# Altium schematic sheet V1.SchDoc
size A4
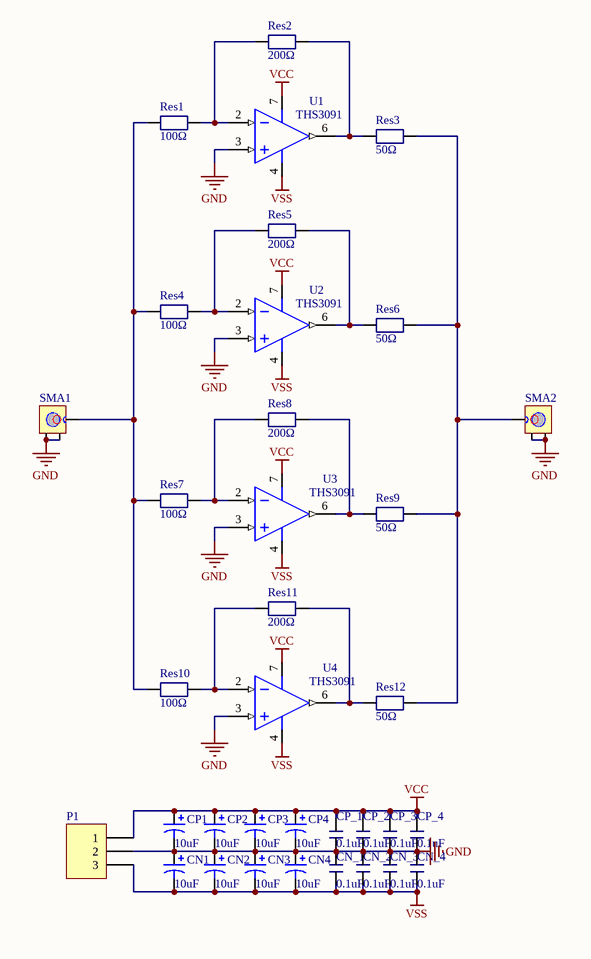
[diagram p0: V1.SchDoc]

## Parts
CN1  value 10uF  [CAP_BTAN]  (hidden comment: Cap Pol1)
CN2  value 10uF  [CAP_BTAN]  (hidden comment: Cap Pol1)
CN3  value 10uF  [CAP_BTAN]  (hidden comment: Cap Pol1)
CN4  value 10uF  [CAP_BTAN]  (hidden comment: Cap Pol1)
CN_1  value 0.1uF  [C0805]  (hidden comment: cap)
CN_2  value 0.1uF  [C0805]  (hidden comment: cap)
CN_3  value 0.1uF  [C0805]  (hidden comment: cap)
CN_4  value 0.1uF  [C0805]  (hidden comment: cap)
CP1  value 10uF  [CAP_BTAN]  (hidden comment: Cap Pol1)
CP2  value 10uF  [CAP_BTAN]  (hidden comment: Cap Pol1)
CP3  value 10uF  [CAP_BTAN]  (hidden comment: Cap Pol1)
CP4  value 10uF  [CAP_BTAN]  (hidden comment: Cap Pol1)
CP_1  value 0.1uF  [C0805]  (hidden comment: cap)
CP_2  value 0.1uF  [C0805]  (hidden comment: cap)
CP_3  value 0.1uF  [C0805]  (hidden comment: cap)
CP_4  value 0.1uF  [C0805]  (hidden comment: cap)
P1  Header 3  [HDR1X3]  (value not drawn)
Res1  value 100Ω  [C0805]  (hidden comment: Res)
Res2  value 200Ω  [R-AXIAL0.3]  (hidden comment: Res)
Res3  value 50Ω  [C0805]  (hidden comment: Res)
Res4  value 100Ω  [C0805]  (hidden comment: Res)
Res5  value 200Ω  [R-AXIAL0.3]  (hidden comment: Res)
Res6  value 50Ω  [C0805]  (hidden comment: Res)
Res7  value 100Ω  [C0805]  (hidden comment: Res)
Res8  value 200Ω  [R-AXIAL0.3]  (hidden comment: Res)
Res9  value 50Ω  [C0805]  (hidden comment: Res)
Res10  value 100Ω  [C0805]  (hidden comment: Res)
Res11  value 200Ω  [R-AXIAL0.3]  (hidden comment: Res)
Res12  value 50Ω  [C0805]  (hidden comment: Res)
SMA1  SMA-xie  [sma-xie]  (value not drawn)
SMA2  SMA-xie  [sma-xie]  (value not drawn)
U1  THS3091  [SOIC-8D]
U2  THS3091  [SOIC-8D]
U3  THS3091  [SOIC-8D]
U4  THS3091  [SOIC-8D]

## Nets
GND: CN1.1 CN2.1 CN3.1 CN4.1 CN_1.1 CN_2.1 CN_3.1 CN_4.1 CP1.2 CP2.2 CP3.2 CP4.2 CP_1.2 CP_2.2 CP_3.2 CP_4.2 P1.2 SMA1.1(gnd) SMA1.3(gnd) SMA2.1(gnd) SMA2.3(gnd) U1.3(IN+) U2.3(IN+) U3.3(IN+) U4.3(IN+)
VCC: CP1.1 CP2.1 CP3.1 CP4.1 CP_1.1 CP_2.1 CP_3.1 CP_4.1 P1.1 U1.7(V+) U2.7(V+) U3.7(V+) U4.7(V+)
VSS: CN1.2 CN2.2 CN3.2 CN4.2 CN_1.2 CN_2.2 CN_3.2 CN_4.2 P1.3 U1.4(V-) U2.4(V-) U3.4(V-) U4.4(V-)
NetRes1_1: Res1.1 Res4.1 Res7.1 Res10.1 SMA1.2(signal)
NetRes1_2: Res1.2 Res2.1 U1.2(IN-)
NetRes2_2: Res2.2 Res3.1 U1.6(OUT)
NetRes3_2: Res3.2 Res6.2 Res9.2 Res12.2 SMA2.2(signal)
NetRes4_2: Res4.2 Res5.1 U2.2(IN-)
NetRes5_2: Res5.2 Res6.1 U2.6(OUT)
NetRes7_2: Res7.2 Res8.1 U3.2(IN-)
NetRes8_2: Res8.2 Res9.1 U3.6(OUT)
NetRes10_2: Res10.2 Res11.1 U4.2(IN-)
NetRes11_2: Res11.2 Res12.1 U4.6(OUT)

## Library data of the parts
CN1-CN4 CP1-CP4 = Cap Pol1: Polarized Capacitor (Radial); Published: 8-Jun-2000; LatestRevisionDate: 17-Jul-2002; LatestRevisionNote: Re-released for DXP Platform.; PackageReference: RB7.6-15; Publisher: Altium Limited
CN_1-CN_4 CP_1-CP_4 = cap: 贴片电容
P1 = Header 3: Header, 3-Pin; LatestRevisionDate: 17-Jul-2002; LatestRevisionNote: Re-released for DXP Platform.; Publisher: Altium Limited
Res1-Res12 = Res: 适用于0805的贴片元件，包括磁珠
SMA1 SMA2 = SMA-xie: 外螺内孔，斜角，或直四角斜着放置
U1-U4 = THS3091: 单路高压低失真电流反馈 运放 ,通常申请DDA，即下方带有热焊盘的，有利于散热